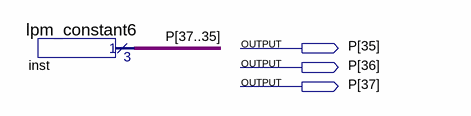
[diagram p0: schematic sheet]
// Quartus schematic MODE.bdf as structural Verilog: 1 symbols, 3 pins
module MODE (
  output [37:35] P
);

  lpm_constant6 inst (.result(P));
endmodule
